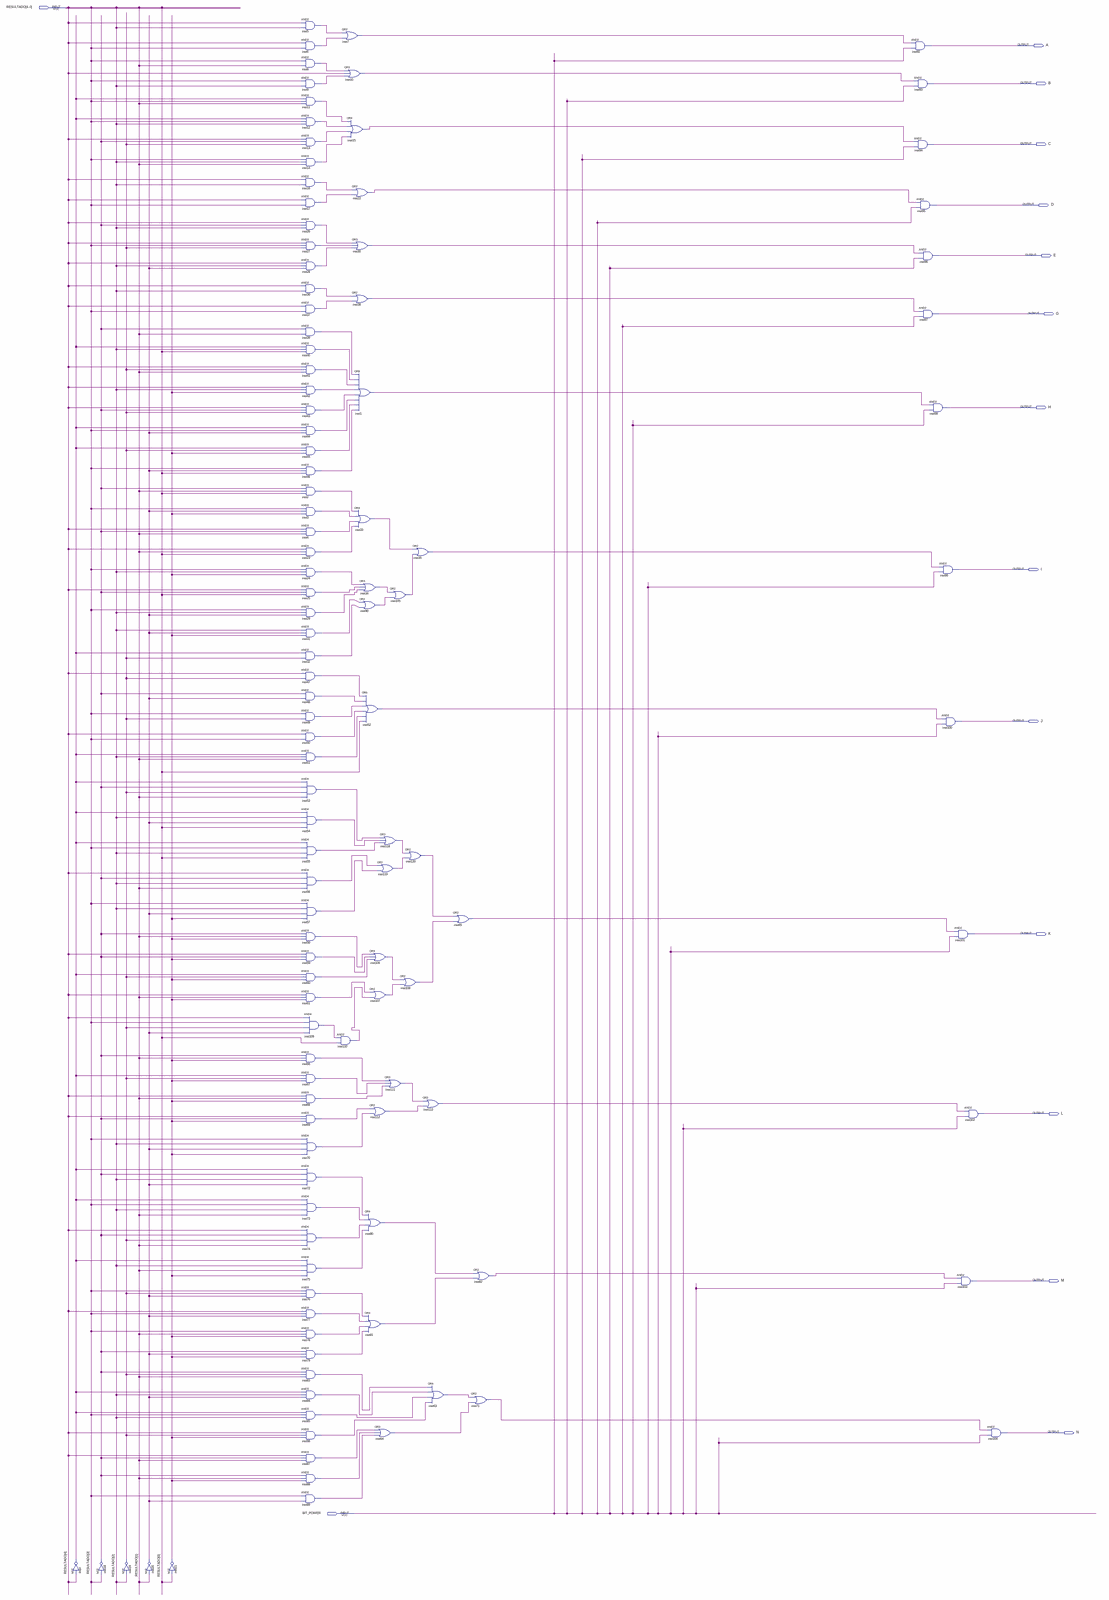
[diagram p0: schematic sheet, whole]
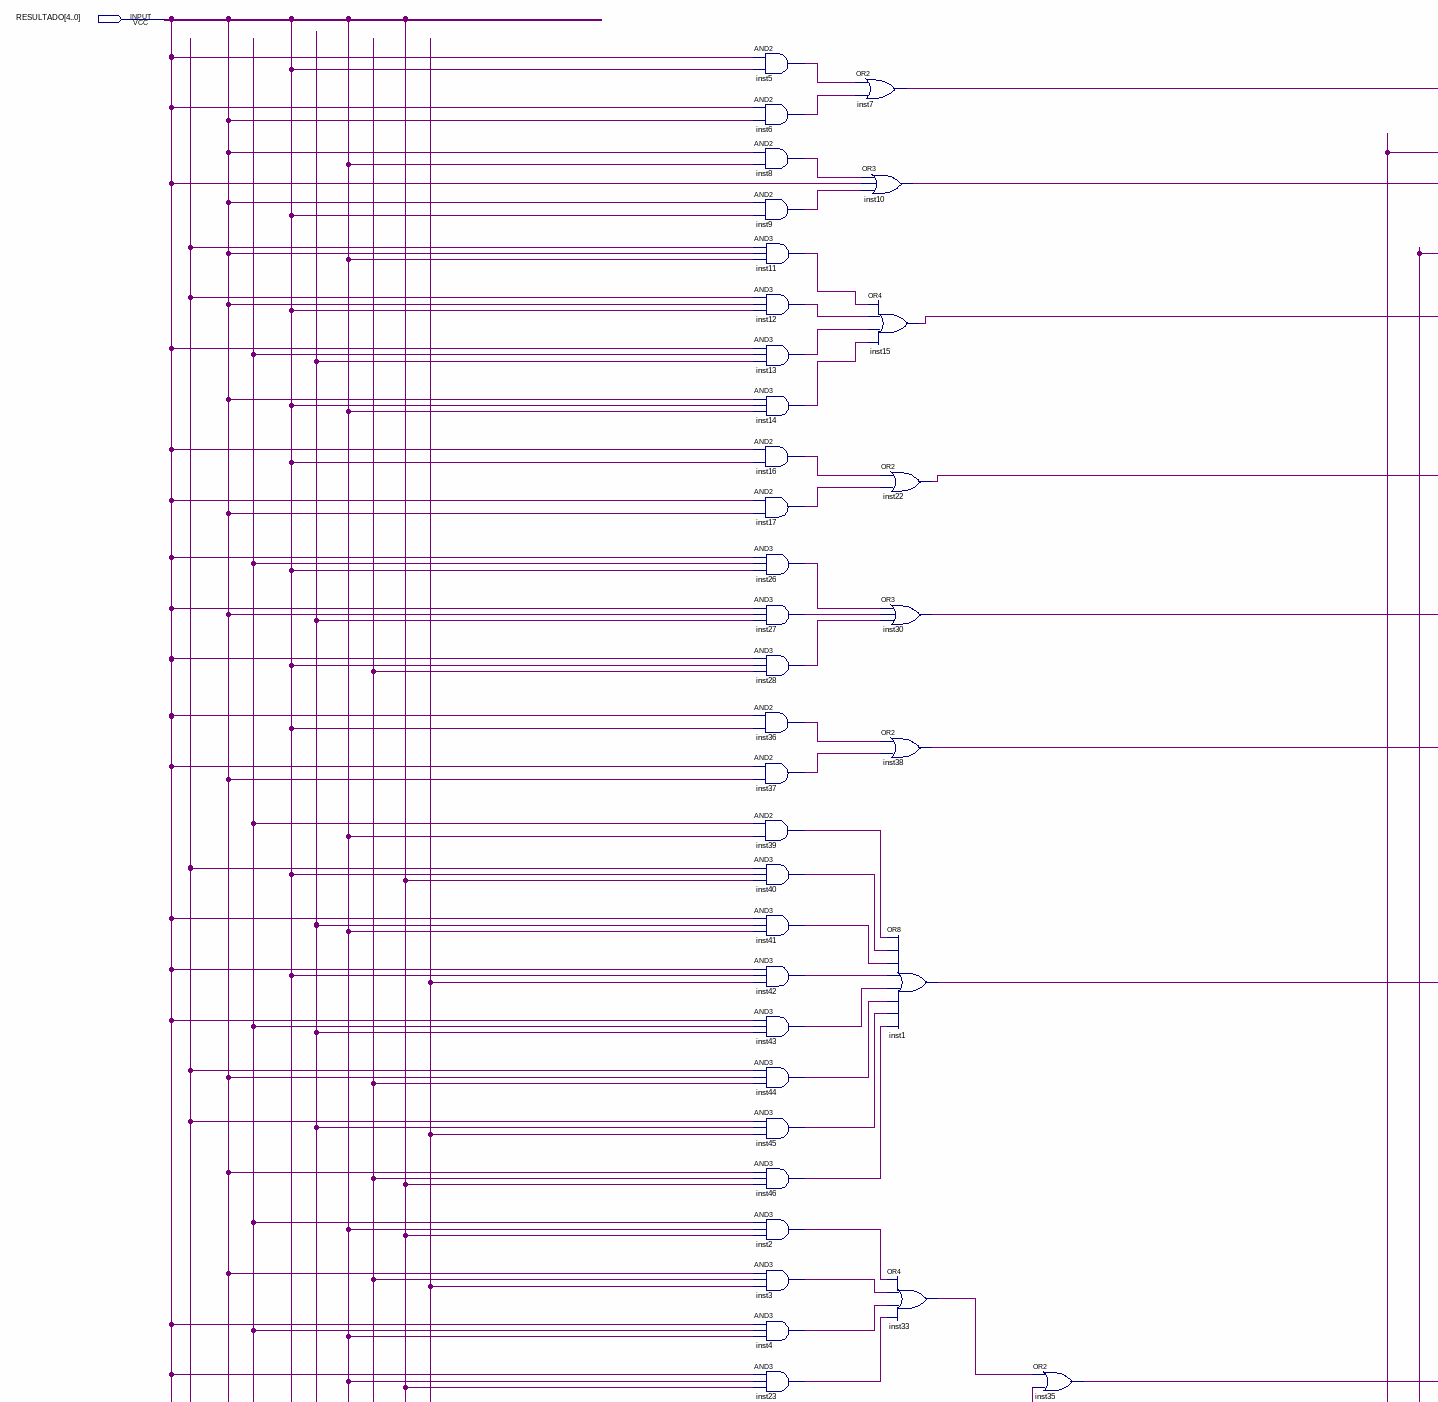
[diagram p1: schematic sheet, upper left part]
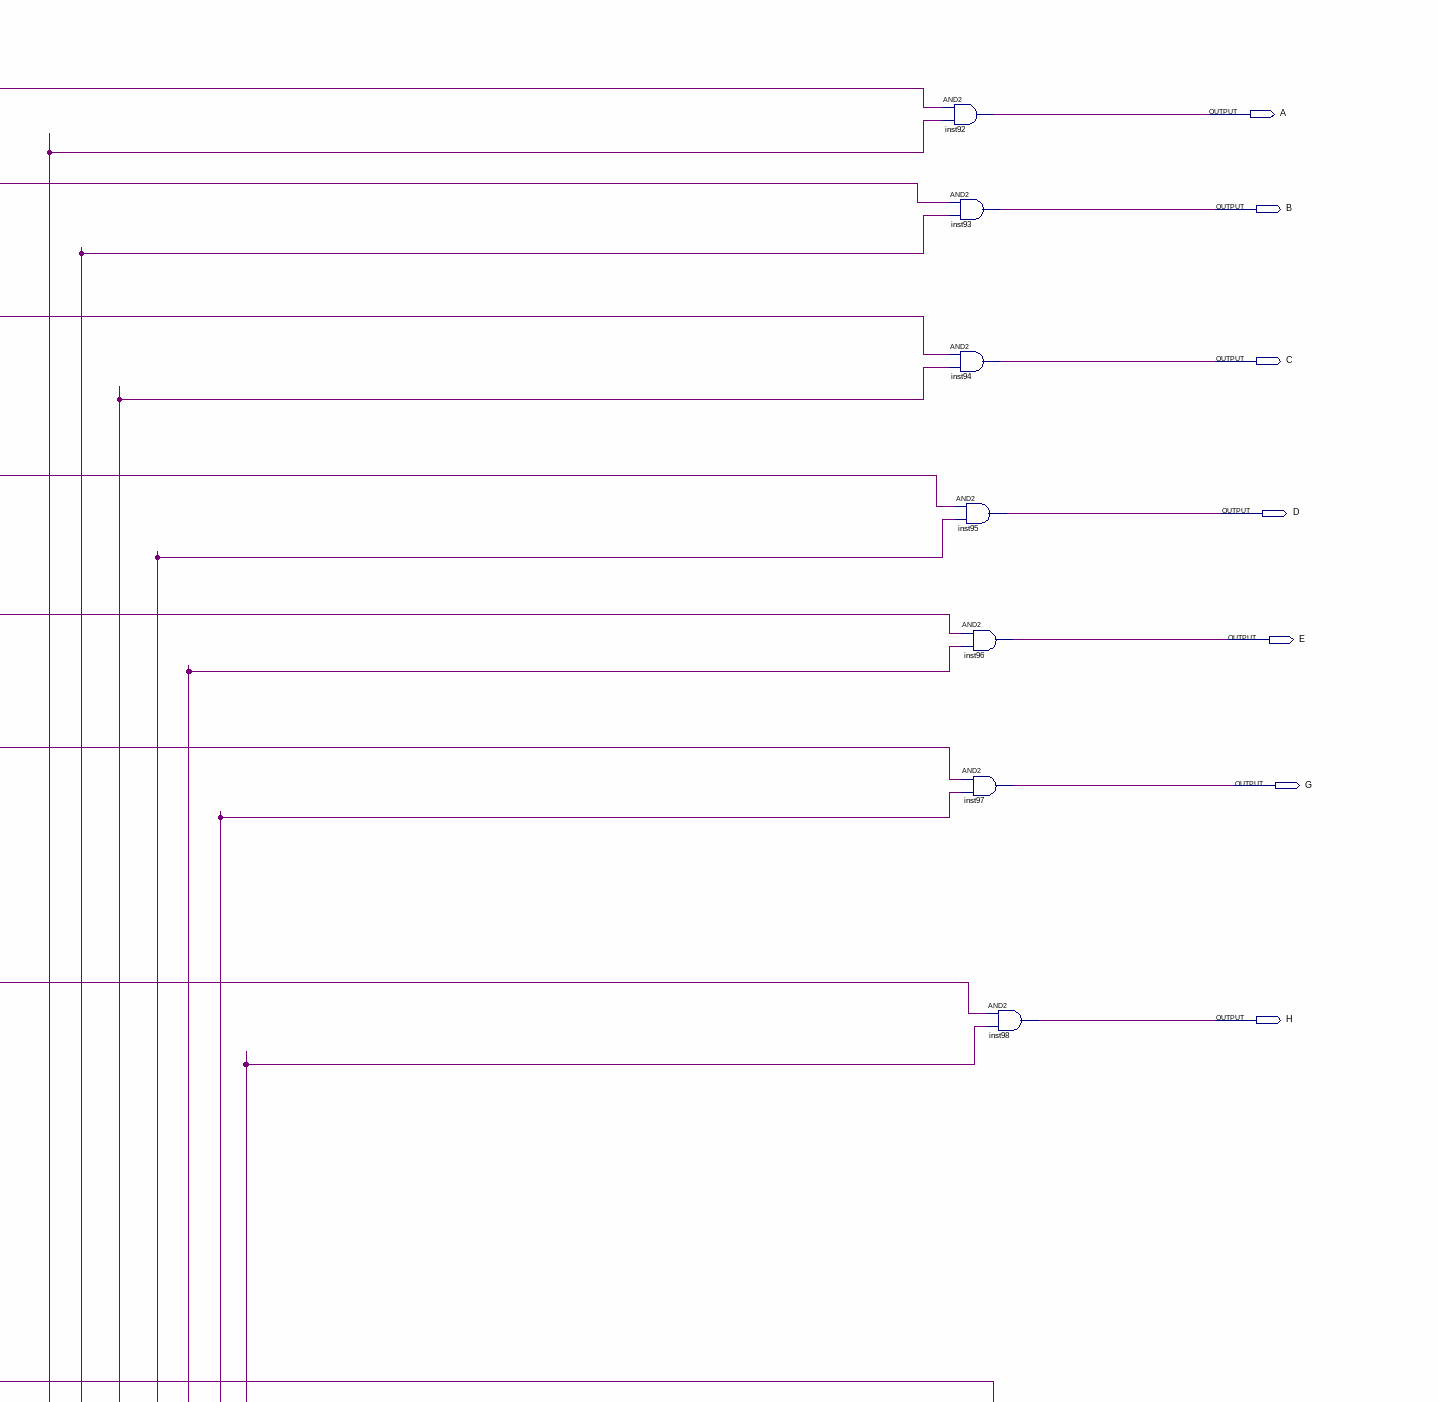
[diagram p2: schematic sheet, upper right part]
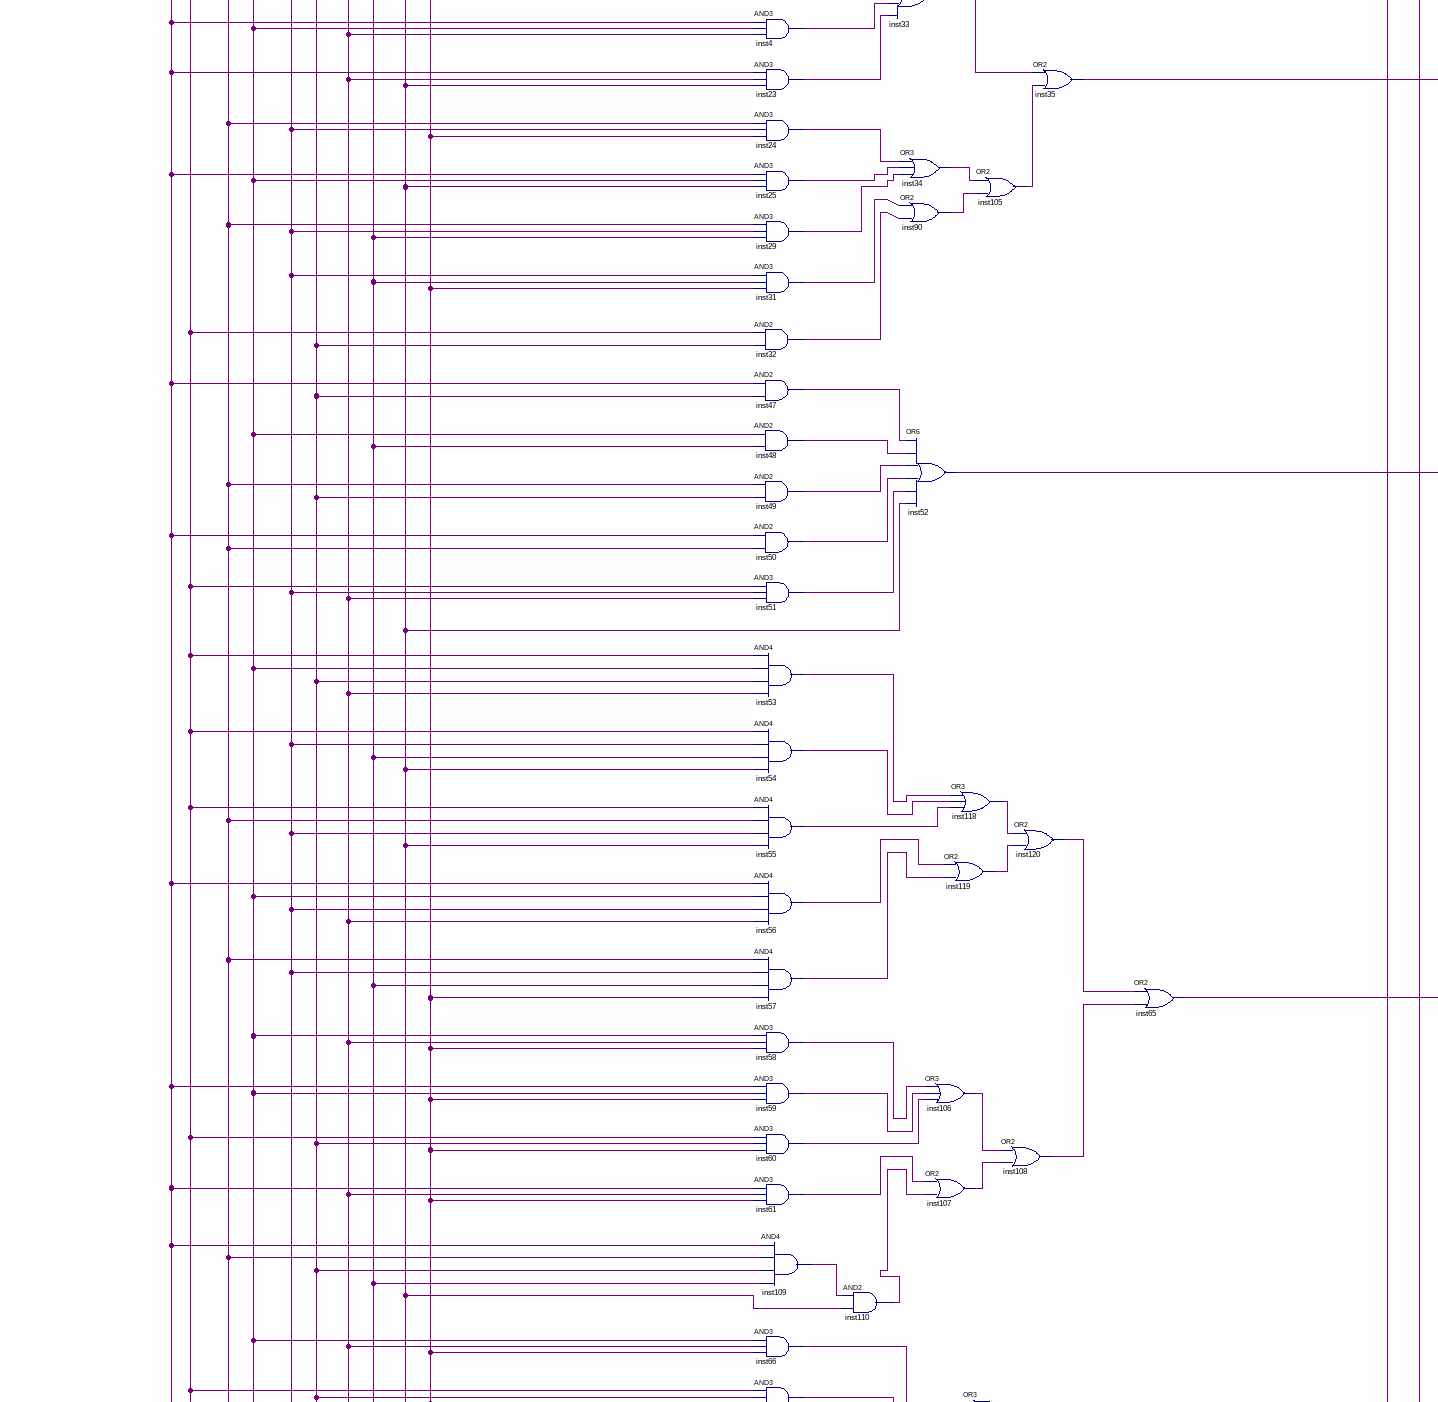
[diagram p3: schematic sheet, middle left part]
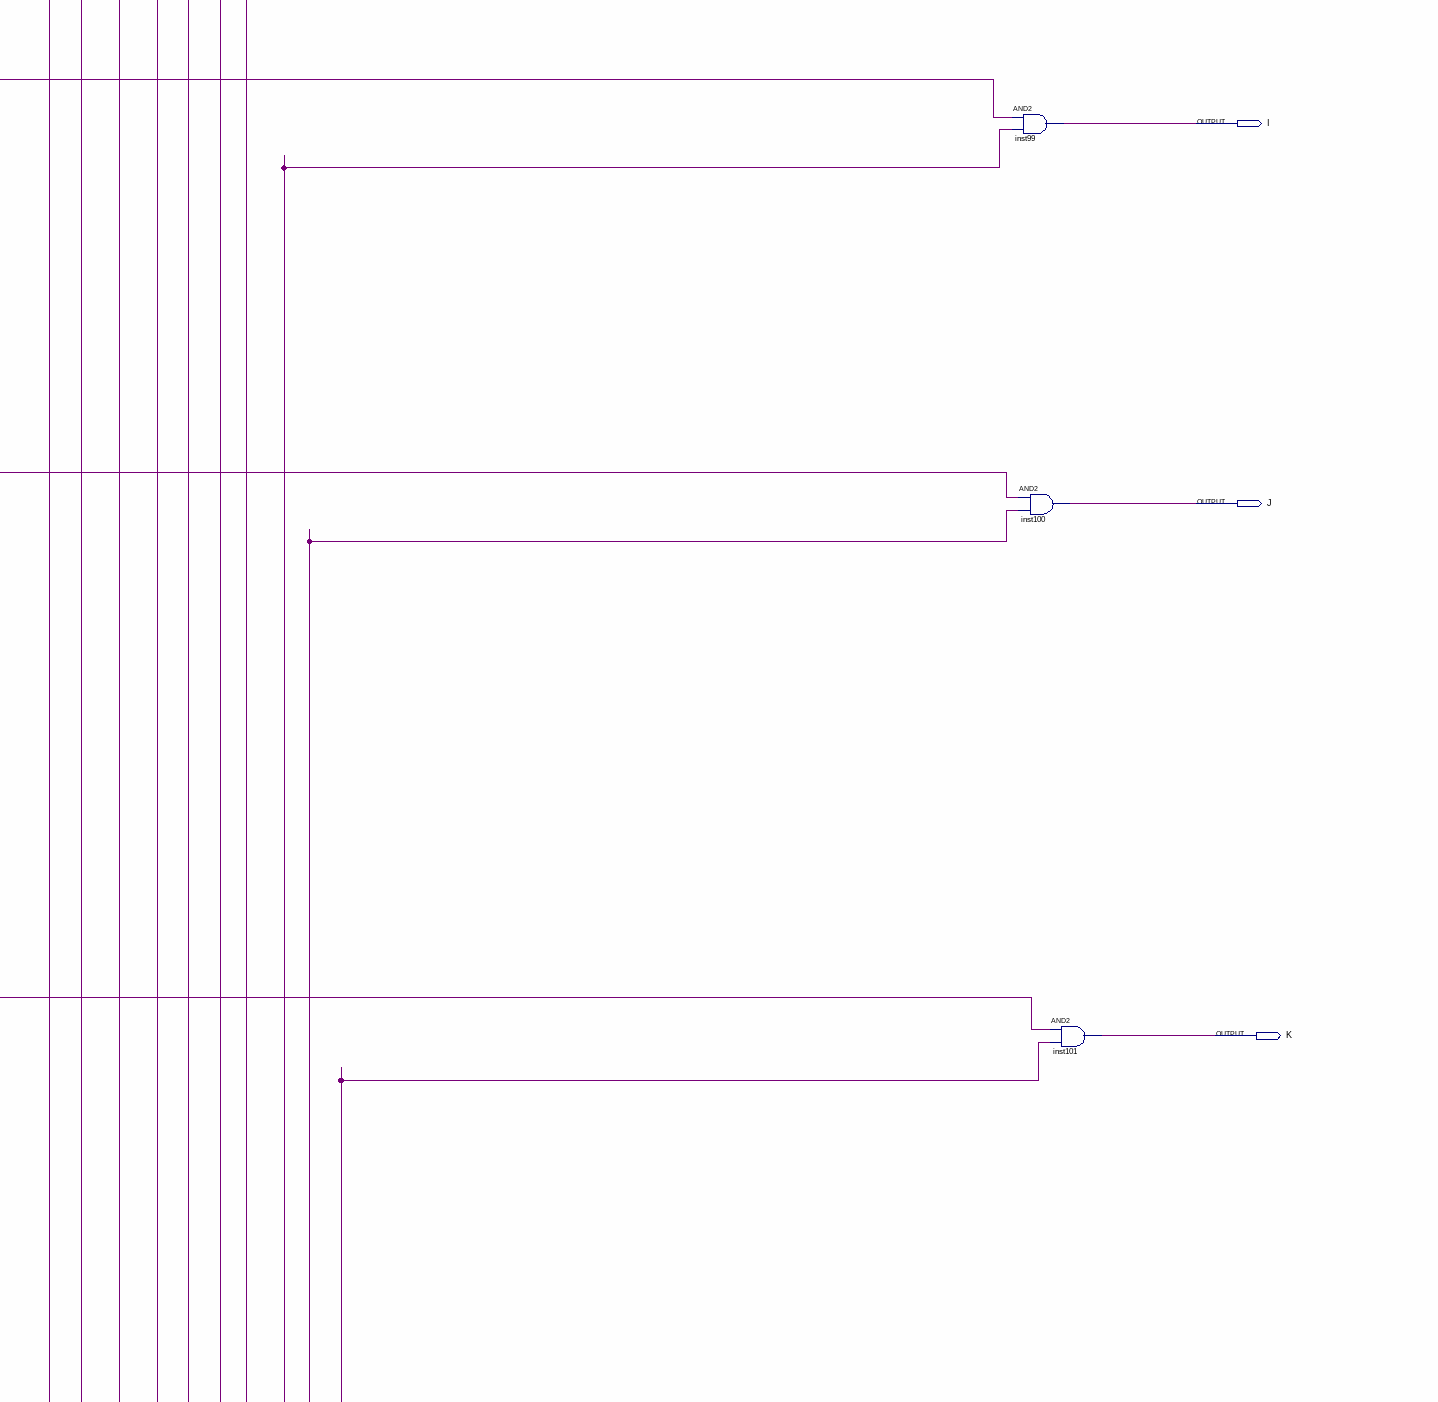
[diagram p4: schematic sheet, middle right part]
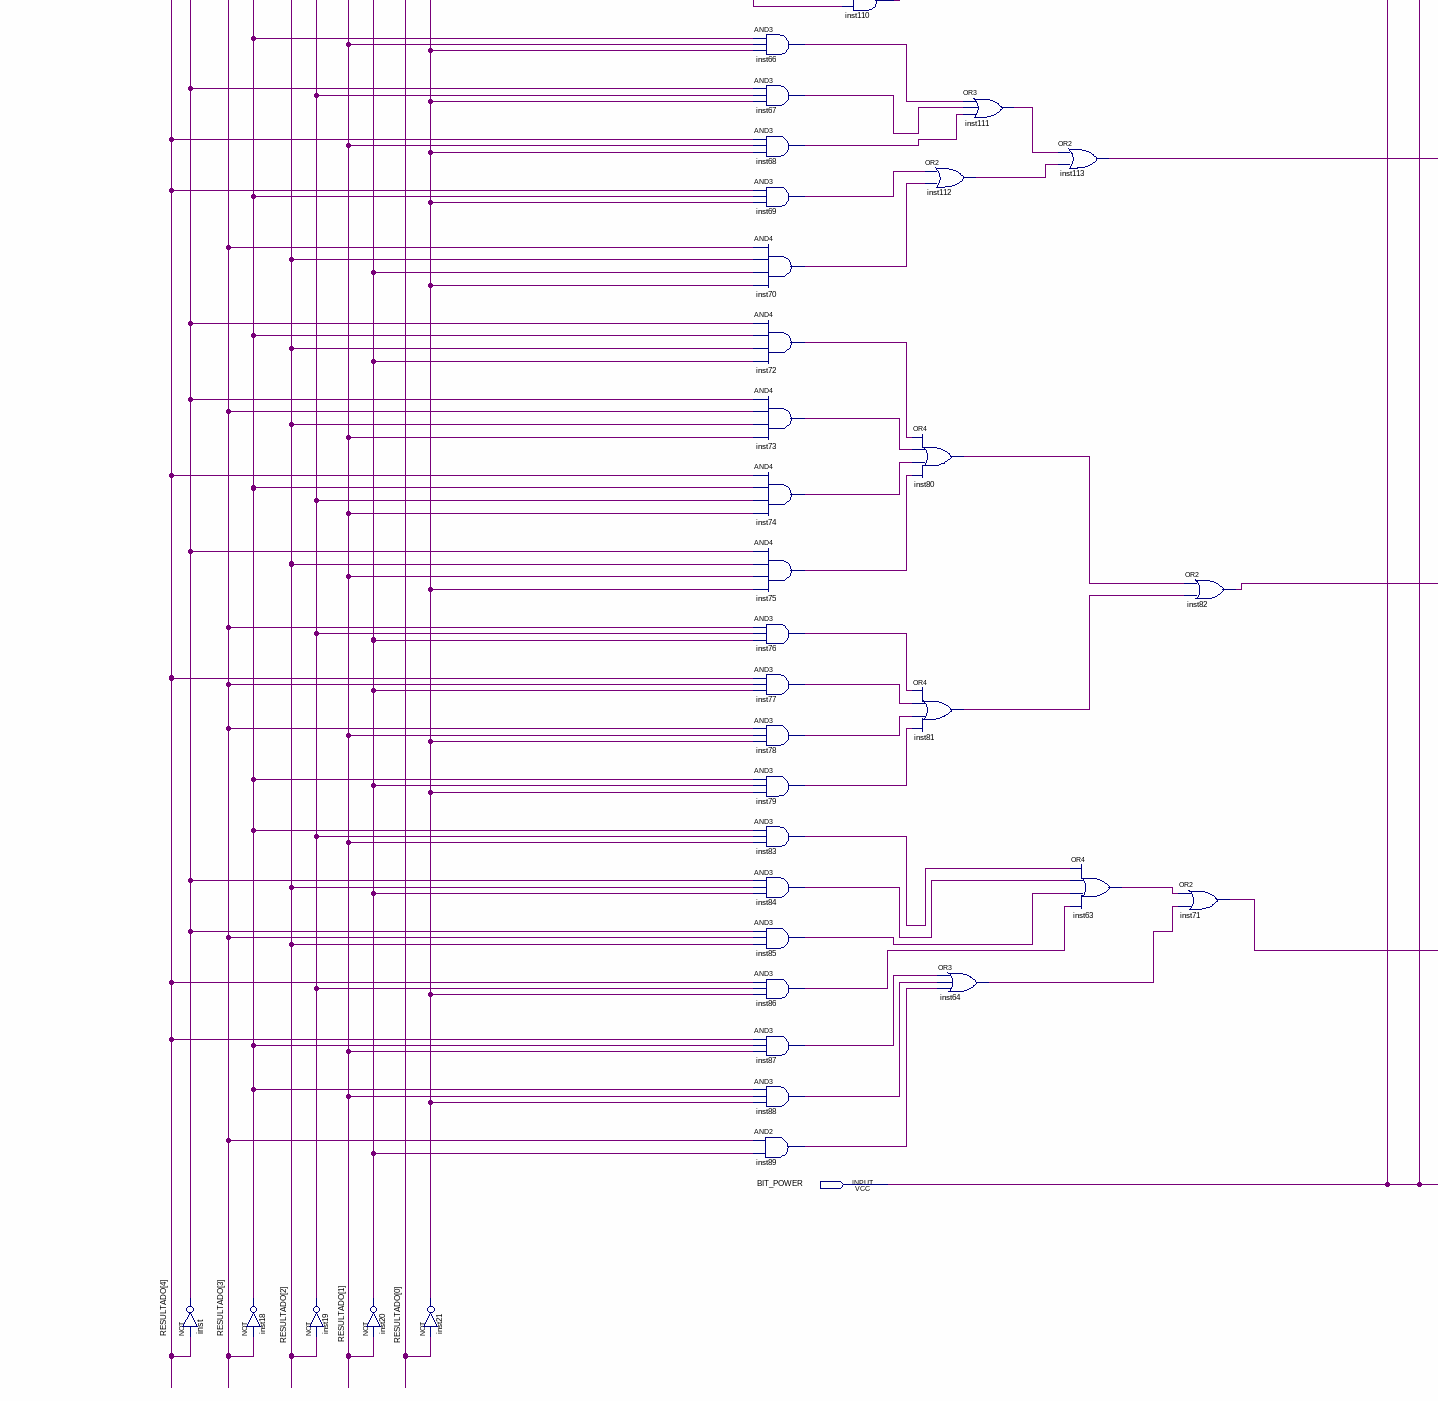
[diagram p5: schematic sheet, lower left part]
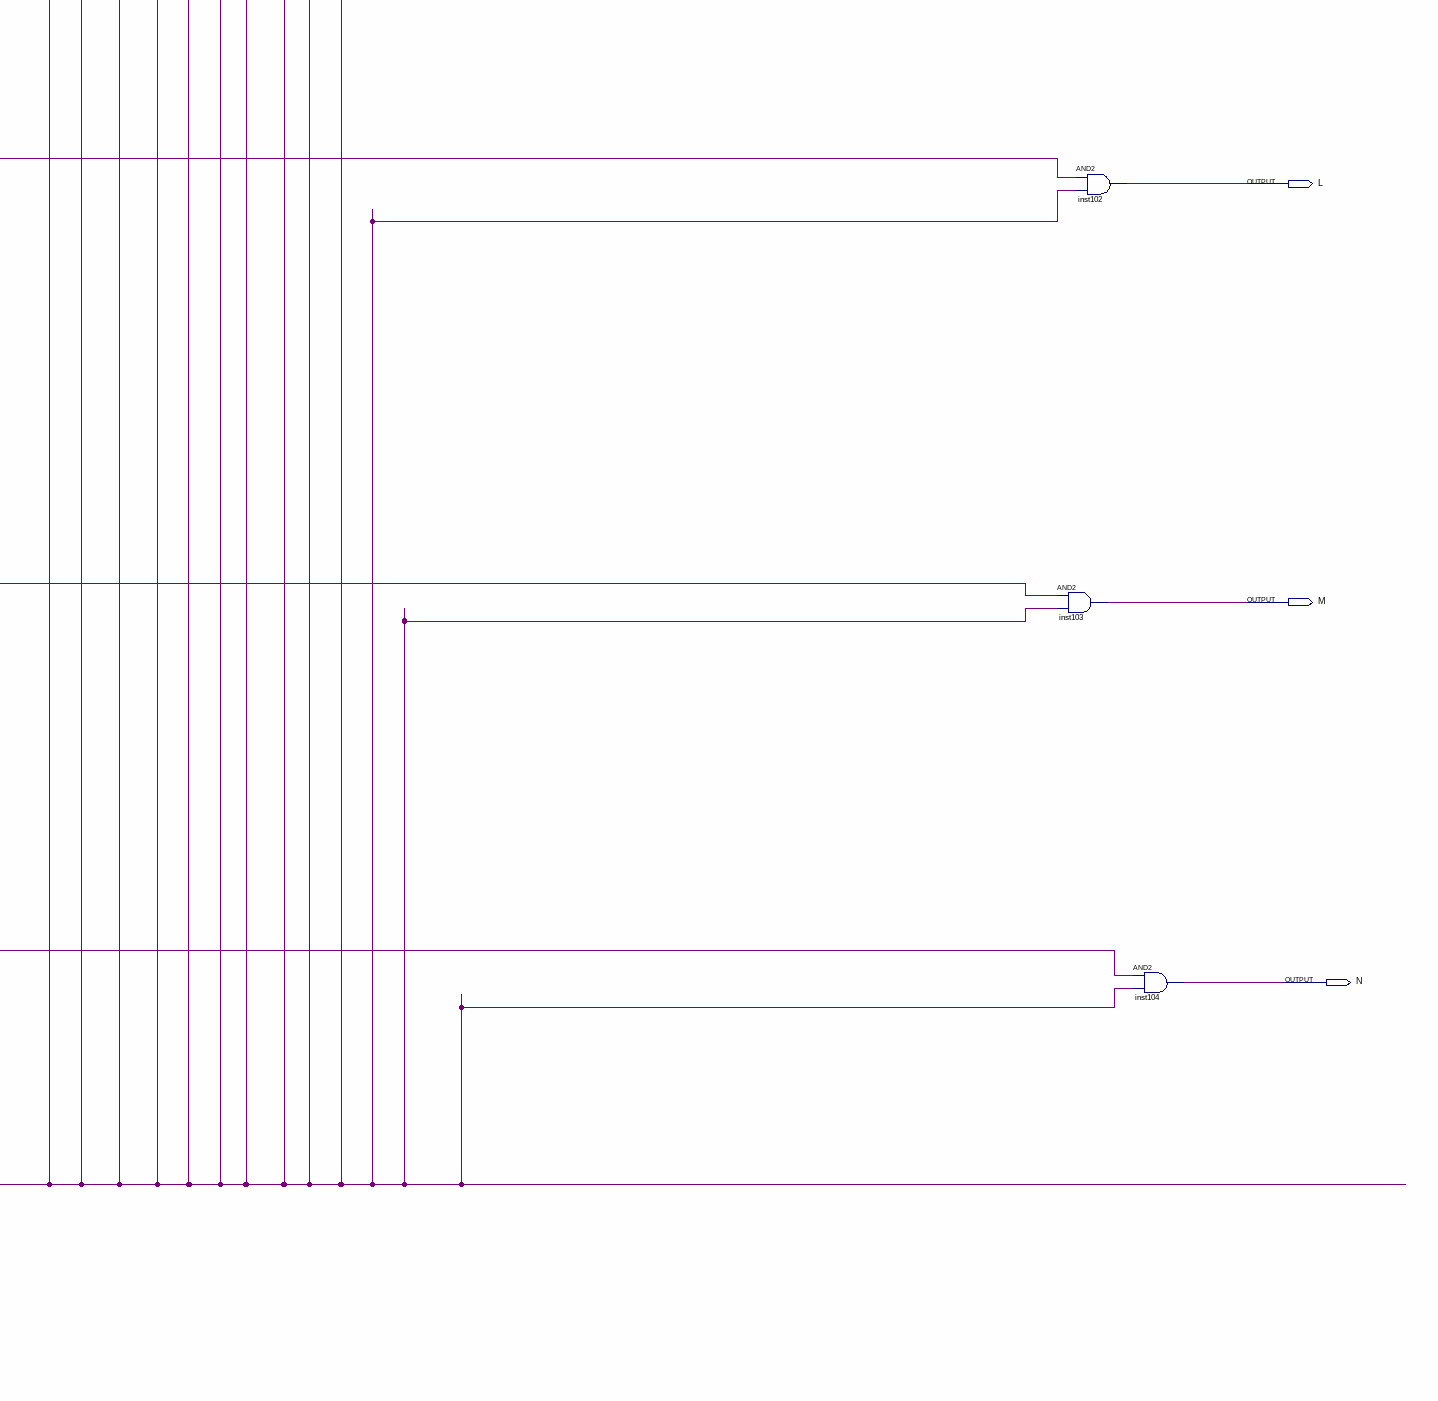
[diagram p6: schematic sheet, lower right part]
// Quartus schematic Decodificador.bdf as structural Verilog: 115 symbols, 15 pins
module Decodificador (
  input  [4:0] RESULTADO,
  input  BIT_POWER,
  output A,
  output B,
  output C,
  output D,
  output E,
  output G,
  output H,
  output I,
  output J,
  output K,
  output L,
  output M,
  output N
);

  wire inst1_out, inst2_out, inst3_out, inst4_out, inst5_out, inst6_out, inst7_out, inst8_out, inst9_out,
       inst10_out, inst11_out, inst12_out, inst13_out, inst14_out, inst15_out, inst16_out, inst17_out,
       inst18_out, inst19_out, inst20_out, inst21_out, inst22_out, inst23_out, inst24_out, inst25_out,
       inst26_out, inst27_out, inst28_out, inst29_out, inst30_out, inst31_out, inst32_out, inst33_out,
       inst34_out, inst35_out, inst36_out, inst37_out, inst38_out, inst39_out, inst40_out, inst41_out,
       inst42_out, inst43_out, inst44_out, inst45_out, inst46_out, inst47_out, inst48_out, inst49_out,
       inst50_out, inst51_out, inst52_out, inst53_out, inst54_out, inst55_out, inst56_out, inst57_out,
       inst58_out, inst59_out, inst60_out, inst61_out, inst63_out, inst64_out, inst65_out, inst66_out,
       inst67_out, inst68_out, inst69_out, inst70_out, inst71_out, inst72_out, inst73_out, inst74_out,
       inst75_out, inst76_out, inst77_out, inst78_out, inst79_out, inst80_out, inst81_out, inst82_out,
       inst83_out, inst84_out, inst85_out, inst86_out, inst87_out, inst88_out, inst89_out, inst90_out,
       inst105_out, inst106_out, inst107_out, inst108_out, inst109_out, inst110_out, inst111_out,
       inst112_out, inst113_out, inst118_out, inst119_out, inst120_out, inst_out;

  not inst (inst_out, RESULTADO[4]);
  not inst18 (inst18_out, RESULTADO[3]);
  not inst19 (inst19_out, RESULTADO[2]);
  not inst20 (inst20_out, RESULTADO[1]);
  not inst21 (inst21_out, RESULTADO[0]);
  and inst5 (inst5_out, RESULTADO[4], RESULTADO[2]);
  and inst6 (inst6_out, RESULTADO[4], RESULTADO[3]);
  and inst8 (inst8_out, RESULTADO[3], RESULTADO[1]);
  and inst9 (inst9_out, RESULTADO[3], RESULTADO[2]);
  and inst11 (inst11_out, inst_out, RESULTADO[3], RESULTADO[1]);
  and inst12 (inst12_out, inst_out, RESULTADO[3], RESULTADO[2]);
  and inst13 (inst13_out, RESULTADO[4], inst18_out, inst19_out);
  and inst14 (inst14_out, RESULTADO[3], RESULTADO[2], RESULTADO[1]);
  and inst16 (inst16_out, RESULTADO[4], RESULTADO[2]);
  and inst17 (inst17_out, RESULTADO[4], RESULTADO[3]);
  and inst26 (inst26_out, RESULTADO[4], inst18_out, RESULTADO[2]);
  and inst27 (inst27_out, RESULTADO[4], RESULTADO[3], inst19_out);
  and inst28 (inst28_out, RESULTADO[4], RESULTADO[2], inst20_out);
  and inst36 (inst36_out, RESULTADO[4], RESULTADO[2]);
  and inst37 (inst37_out, RESULTADO[4], RESULTADO[3]);
  and inst39 (inst39_out, inst18_out, RESULTADO[1]);
  and inst40 (inst40_out, inst_out, RESULTADO[2], RESULTADO[0]);
  and inst41 (inst41_out, RESULTADO[4], inst19_out, RESULTADO[1]);
  and inst42 (inst42_out, RESULTADO[4], RESULTADO[2], inst21_out);
  and inst43 (inst43_out, RESULTADO[4], inst18_out, inst19_out);
  and inst44 (inst44_out, inst_out, RESULTADO[3], inst20_out);
  and inst45 (inst45_out, inst_out, inst19_out, inst21_out);
  and inst46 (inst46_out, RESULTADO[3], inst20_out, RESULTADO[0]);
  and inst2 (inst2_out, inst18_out, RESULTADO[1], RESULTADO[0]);
  and inst3 (inst3_out, RESULTADO[3], inst20_out, inst21_out);
  and inst4 (inst4_out, RESULTADO[4], inst18_out, RESULTADO[1]);
  and inst23 (inst23_out, RESULTADO[4], RESULTADO[1], RESULTADO[0]);
  and inst24 (inst24_out, RESULTADO[3], RESULTADO[2], inst21_out);
  and inst25 (inst25_out, RESULTADO[4], inst18_out, RESULTADO[0]);
  and inst29 (inst29_out, RESULTADO[3], RESULTADO[2], inst20_out);
  and inst31 (inst31_out, RESULTADO[2], inst20_out, inst21_out);
  and inst32 (inst32_out, inst_out, inst19_out);
  and inst47 (inst47_out, RESULTADO[4], inst19_out);
  and inst48 (inst48_out, inst18_out, inst20_out);
  and inst49 (inst49_out, RESULTADO[3], inst19_out);
  and inst50 (inst50_out, RESULTADO[4], RESULTADO[3]);
  and inst51 (inst51_out, inst_out, RESULTADO[2], RESULTADO[1]);
  and inst53 (inst53_out, inst_out, inst18_out, inst19_out, RESULTADO[1]);
  and inst54 (inst54_out, inst_out, RESULTADO[2], inst20_out, RESULTADO[0]);
  and inst55 (inst55_out, inst_out, RESULTADO[3], RESULTADO[2], RESULTADO[0]);
  and inst56 (inst56_out, RESULTADO[4], inst18_out, RESULTADO[2], RESULTADO[1]);
  and inst57 (inst57_out, RESULTADO[3], RESULTADO[2], inst20_out, inst21_out);
  and inst58 (inst58_out, inst18_out, RESULTADO[1], inst21_out);
  and inst59 (inst59_out, RESULTADO[4], inst18_out, inst21_out);
  and inst60 (inst60_out, inst_out, inst19_out, inst21_out);
  and inst61 (inst61_out, RESULTADO[4], RESULTADO[1], inst21_out);
  and inst109 (inst109_out, RESULTADO[4], RESULTADO[3], inst19_out, inst20_out);
  and inst66 (inst66_out, inst18_out, RESULTADO[1], inst21_out);
  and inst67 (inst67_out, inst_out, inst19_out, inst21_out);
  and inst68 (inst68_out, RESULTADO[4], RESULTADO[1], inst21_out);
  and inst69 (inst69_out, RESULTADO[4], inst18_out, inst21_out);
  and inst70 (inst70_out, RESULTADO[3], RESULTADO[2], inst20_out, inst21_out);
  and inst72 (inst72_out, inst_out, inst18_out, RESULTADO[2], inst20_out);
  and inst73 (inst73_out, inst_out, RESULTADO[3], RESULTADO[2], RESULTADO[1]);
  and inst74 (inst74_out, RESULTADO[4], inst18_out, inst19_out, RESULTADO[1]);
  and inst75 (inst75_out, inst_out, RESULTADO[2], RESULTADO[1], inst21_out);
  and inst76 (inst76_out, RESULTADO[3], inst19_out, inst20_out);
  and inst77 (inst77_out, RESULTADO[4], RESULTADO[3], inst20_out);
  and inst78 (inst78_out, RESULTADO[3], RESULTADO[1], inst21_out);
  and inst79 (inst79_out, inst18_out, inst20_out, inst21_out);
  and inst83 (inst83_out, inst18_out, inst19_out, RESULTADO[1]);
  and inst84 (inst84_out, inst_out, RESULTADO[2], inst20_out);
  and inst85 (inst85_out, inst_out, RESULTADO[3], RESULTADO[2]);
  and inst86 (inst86_out, RESULTADO[4], inst19_out, inst21_out);
  and inst87 (inst87_out, RESULTADO[4], inst18_out, RESULTADO[1]);
  and inst88 (inst88_out, inst18_out, RESULTADO[1], inst21_out);
  and inst89 (inst89_out, RESULTADO[3], inst20_out);
  or inst7 (inst7_out, inst5_out, inst6_out);
  or inst10 (inst10_out, inst8_out, RESULTADO[4], inst9_out);
  or inst15 (inst15_out, inst11_out, inst12_out, inst13_out, inst14_out);
  and inst110 (inst110_out, inst109_out, RESULTADO[0]);
  or inst22 (inst22_out, inst16_out, inst17_out);
  or inst30 (inst30_out, inst26_out, inst27_out, inst28_out);
  or inst38 (inst38_out, inst36_out, inst37_out);
  or inst1 (inst1_out, inst39_out, inst40_out, inst41_out, inst42_out, inst43_out, inst44_out, inst45_out, inst46_out);
  or inst33 (inst33_out, inst2_out, inst3_out, inst4_out, inst23_out);
  or inst34 (inst34_out, inst24_out, inst25_out, inst29_out);
  or inst90 (inst90_out, inst31_out, inst32_out);
  or inst52 (inst52_out, inst47_out, inst48_out, inst49_out, inst50_out, inst51_out, RESULTADO[0]);
  or inst106 (inst106_out, inst58_out, inst59_out, inst60_out);
  or inst107 (inst107_out, inst61_out, inst110_out);
  or inst112 (inst112_out, inst69_out, inst70_out);
  or inst80 (inst80_out, inst72_out, inst73_out, inst74_out, inst75_out);
  or inst81 (inst81_out, inst76_out, inst77_out, inst78_out, inst79_out);
  or inst105 (inst105_out, inst34_out, inst90_out);
  or inst118 (inst118_out, inst53_out, inst54_out, inst55_out);
  or inst119 (inst119_out, inst56_out, inst57_out);
  or inst111 (inst111_out, inst66_out, inst67_out, inst68_out);
  or inst64 (inst64_out, inst87_out, inst88_out, inst89_out);
  or inst120 (inst120_out, inst118_out, inst119_out);
  or inst108 (inst108_out, inst106_out, inst107_out);
  or inst35 (inst35_out, inst33_out, inst105_out);
  or inst113 (inst113_out, inst111_out, inst112_out);
  or inst63 (inst63_out, inst83_out, inst84_out, inst85_out, inst86_out);
  or inst65 (inst65_out, inst120_out, inst108_out);
  or inst71 (inst71_out, inst63_out, inst64_out);
  or inst82 (inst82_out, inst80_out, inst81_out);
  and inst92 (A, inst7_out, BIT_POWER);
  and inst93 (B, inst10_out, BIT_POWER);
  and inst94 (C, inst15_out, BIT_POWER);
  and inst95 (D, inst22_out, BIT_POWER);
  and inst96 (E, inst30_out, BIT_POWER);
  and inst97 (G, inst38_out, BIT_POWER);
  and inst98 (H, inst1_out, BIT_POWER);
  and inst99 (I, inst35_out, BIT_POWER);
  and inst100 (J, inst52_out, BIT_POWER);
  and inst101 (K, inst65_out, BIT_POWER);
  and inst103 (M, inst82_out, BIT_POWER);
  and inst102 (L, inst113_out, BIT_POWER);
  and inst104 (N, inst71_out, BIT_POWER);
endmodule
